# EAGLE design controller-main_3 (EAGLE 8.4.1)
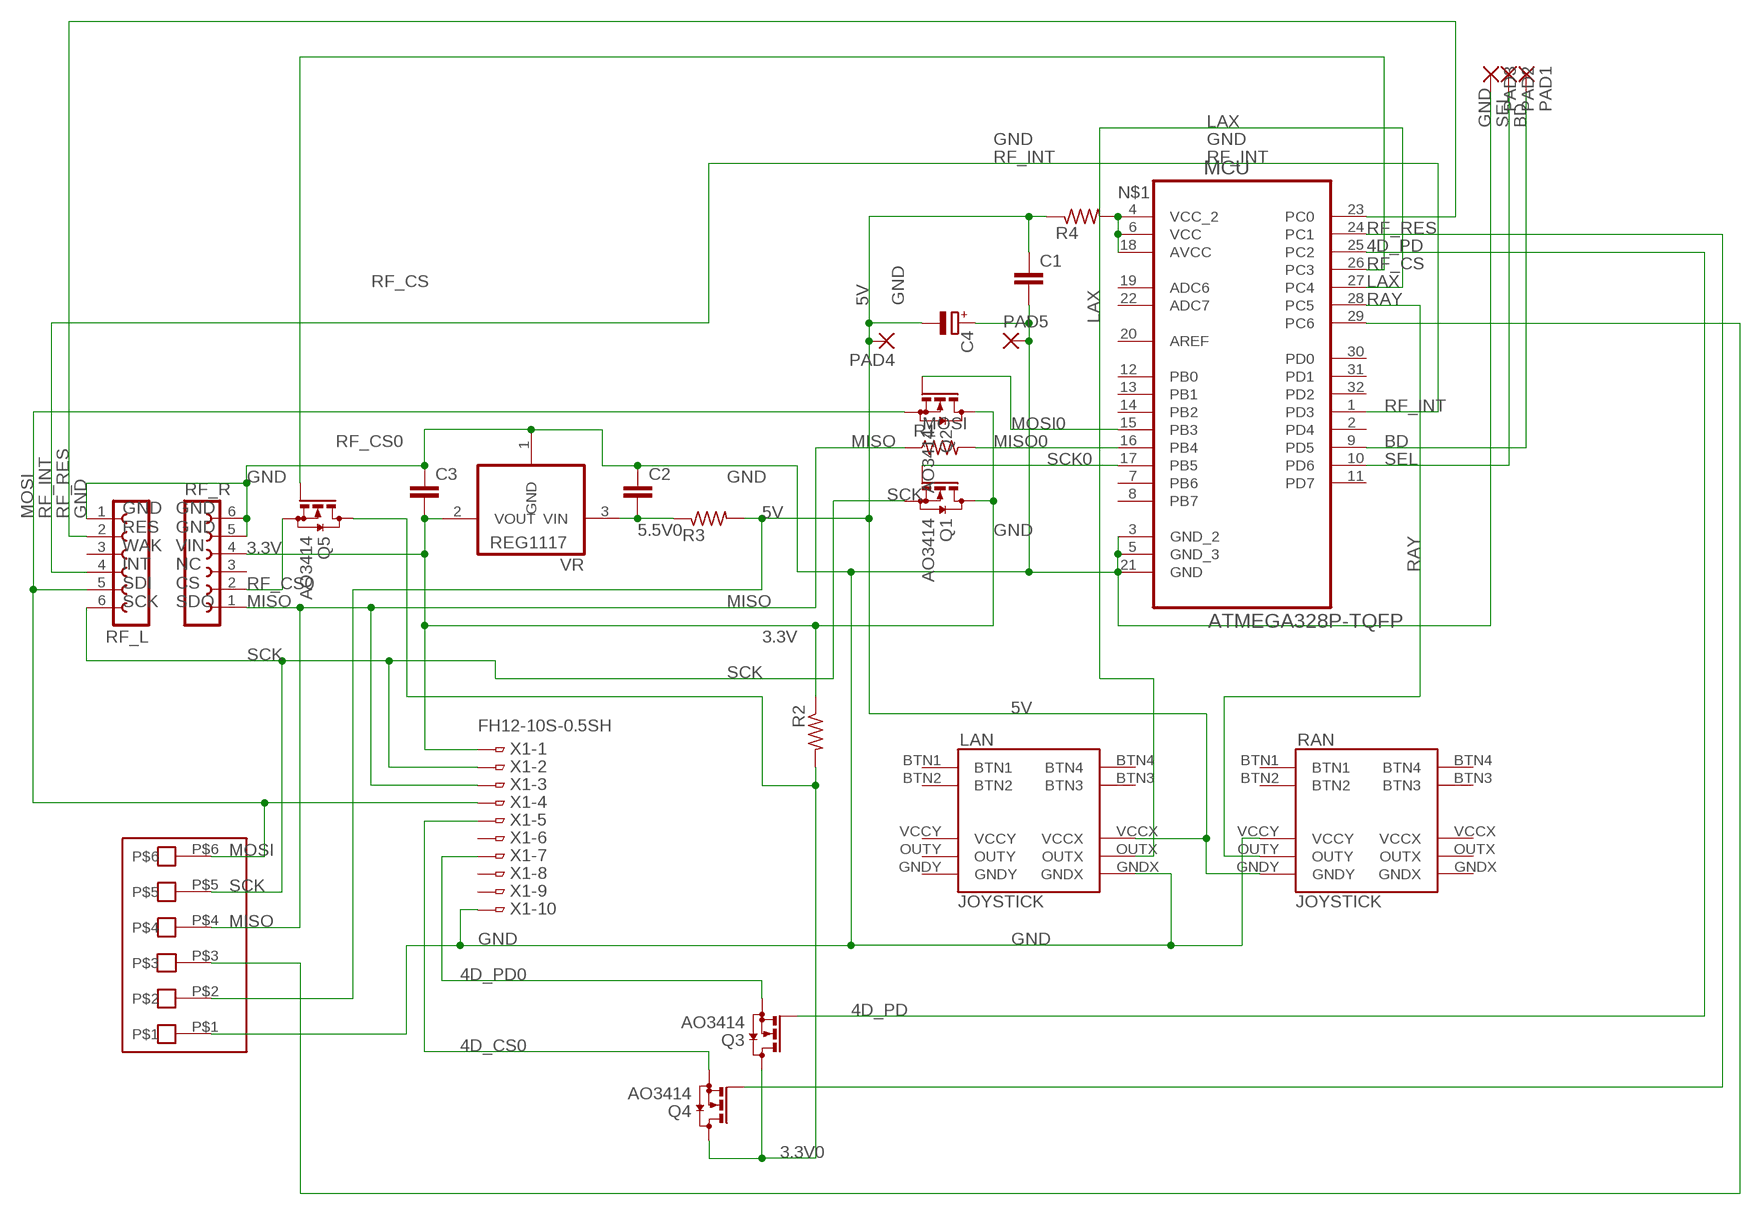
[diagram p0: schematic, sheet 1]

## Parts
C1  C-EUC1206  [C1206]
C2  C-EUC1206  [C1206]
C3  C-EUC1206  [C1206]
C4  CPOL-EU153CLV-0505  [153CLV-0505]
LAN  JOYSTICK  JOYSTICKJOYSTICKWBTN  [JOYSTICK]
MCU  ATMEGA328P-TQFP  ATMEGA328P-AU  [QFP80P900X900X120-32N]
PAD1  SMD2  [SMD1,27-2,54]
PAD2  SMD2  [SMD1,27-2,54]
PAD3  SMD2  [SMD1,27-2,54]
PAD4  SMD5  [SMD2,54-5,08]
PAD5  SMD5  [SMD2,54-5,08]
Q1  AO3414  BSS123  [SOT23]
Q2  AO3414  BSS123  [SOT23]
Q3  AO3414  BSS123  [SOT23]
Q4  AO3414  BSS123  [SOT23]
Q5  AO3414  BSS123  [SOT23]
R1  R-US_R1206  [R1206]
R2  R-US_R1206  [R1206]
R3  R-US_R1206  [R1206]
R4  R-US_R1206  [R1206]
RAN  JOYSTICK  JOYSTICKJOYSTICKWBTN  [JOYSTICK]
RF_L  FE06-1  [FE06]
RF_R  FE06-1  [FE06]
U$1  JTECH-6PV  [PAK-6PV]
VR  REG1117  [SOT223]
X1  FH12-10S-0.5SH  [FH12-10S-0.5SH]

## Nets
3.3V: C3.2 Q1.3(D) Q2.3(D) R2.1 RF_R.4 VR.2(VOUT) X1.1
3.3V0: Q3.3(D) Q4.3(D) Q5.3(D) R2.2
4D_CS: MCU.24(PC1) Q4.1(G)
4D_CS0: Q4.2(S) X1.5
4D_PD: MCU.25(PC2) Q3.1(G)
4D_PD0: Q3.2(S) X1.7
5.5V0: C2.2 R3.1 VR.3(VIN)
5V: C1.1 C4.- LAN.VCCX PAD4.1(P) R3.2 R4.1 RAN.GNDY U$1.P$2
BD: MCU.9(PD5) PAD1.1(P)
GND: C1.2 C2.1 C3.1 C4.+ LAN.GNDX MCU.3(GND_2) MCU.5(GND_3) MCU.21(GND) PAD3.1(P) PAD5.1(P) RAN.VCCY RF_L.1 RF_R.5 RF_R.6 U$1.P$1 VR.1(GND) X1.10
LAX: LAN.OUTX MCU.27(PC4)
MISO: R1.1 RF_R.1 U$1.P$4 X1.3
MISO0: MCU.16(PB4) R1.2
MOSI: Q2.2(S) RF_L.5 U$1.P$6 X1.4
MOSI0: MCU.15(PB3) Q2.1(G)
N$1: MCU.4(VCC_2) MCU.6(VCC) MCU.18(AVCC) R4.2
RAY: MCU.28(PC5) RAN.OUTY
RF_CS: MCU.26(PC3) Q5.1(G)
RF_CS0: Q5.2(S) RF_R.2
RF_INT: MCU.1(PD3) RF_L.4
RF_RES: MCU.23(PC0) RF_L.2
RST: MCU.29(PC6) U$1.P$3
SCK: Q1.2(S) RF_L.6 U$1.P$5 X1.2
SCK0: MCU.17(PB5) Q1.1(G)
SEL: MCU.10(PD6) PAD2.1(P)
Unconnected: LAN.BTN1 LAN.BTN2 LAN.BTN3 LAN.BTN4 LAN.GNDY LAN.OUTY LAN.VCCY MCU.2(PD4) MCU.7(PB6) MCU.8(PB7) MCU.11(PD7) MCU.12(PB0) MCU.13(PB1) MCU.14(PB2) MCU.19(ADC6) MCU.20(AREF) MCU.22(ADC7) MCU.30(PD0) MCU.31(PD1) MCU.32(PD2) RAN.BTN1 RAN.BTN2 RAN.BTN3 RAN.BTN4 RAN.GNDX RAN.OUTX RAN.VCCX RF_L.3 RF_R.3 X1.6 X1.8 X1.9

## Notes on the sheet
- GND
  RES
  WAK
  INT
  SDI
  SCK
- GND
  GND
  VIN
  NC
  CS
  SDO

## Library data of the parts
C1-C3 = resistor:C-EU: CAPACITOR, European symbol
C4 = resistor:CPOL-EU: POLARIZED CAPACITOR, European symbol
LAN RAN = joystick:JOYSTICK
MCU = Atmel_By_element14_Batch_1-00:ATMEGA328P-AU: 8-bit Microcontroller with In-System Programmable Flash; MPN: ATMEGA328P-AU; OC_FARNELL: 1715486; OC_NEWARK: 14R4631; PACKAGE: TQFP-32; SUPPLIER: Atmel
PAD1-PAD3 = wirepad:SMD2: SMD PAD
PAD4 PAD5 = wirepad:SMD5: SMD PAD
Q1-Q5 = transistor-small-signal:BSS123: N-CHANNEL MOS FET
R1-R4 = resistor:R-US_: RESISTOR, American symbol
RF_L RF_R = con-lsta:FE06-1: FEMALE HEADER; OC_FARNELL: unknown; OC_NEWARK: unknown
U$1 = con-jtech:JTECH-6P
VR = burr-brown:REG1117: 800mA and 1A Low Dropout (LDO) Positive Regulator 1.8V, 2.5V, 2.85V, 3.3V, 5V, and Adj; MPN: REG1117; OC_FARNELL: 1097566; OC_NEWARK: 14P6981
X1 = con-hirose:FH12-10S-0.5S: 0.5mm Pitch Connectors For FPC/FFC Source: Data sheet <http://www.hirose.co.jp/cataloge_hp/e58605370.pdf>; MPN: FH12-10S-0.5SH(55); OC_FARNELL: 1324540; OC_NEWARK: 34M6152

## Board
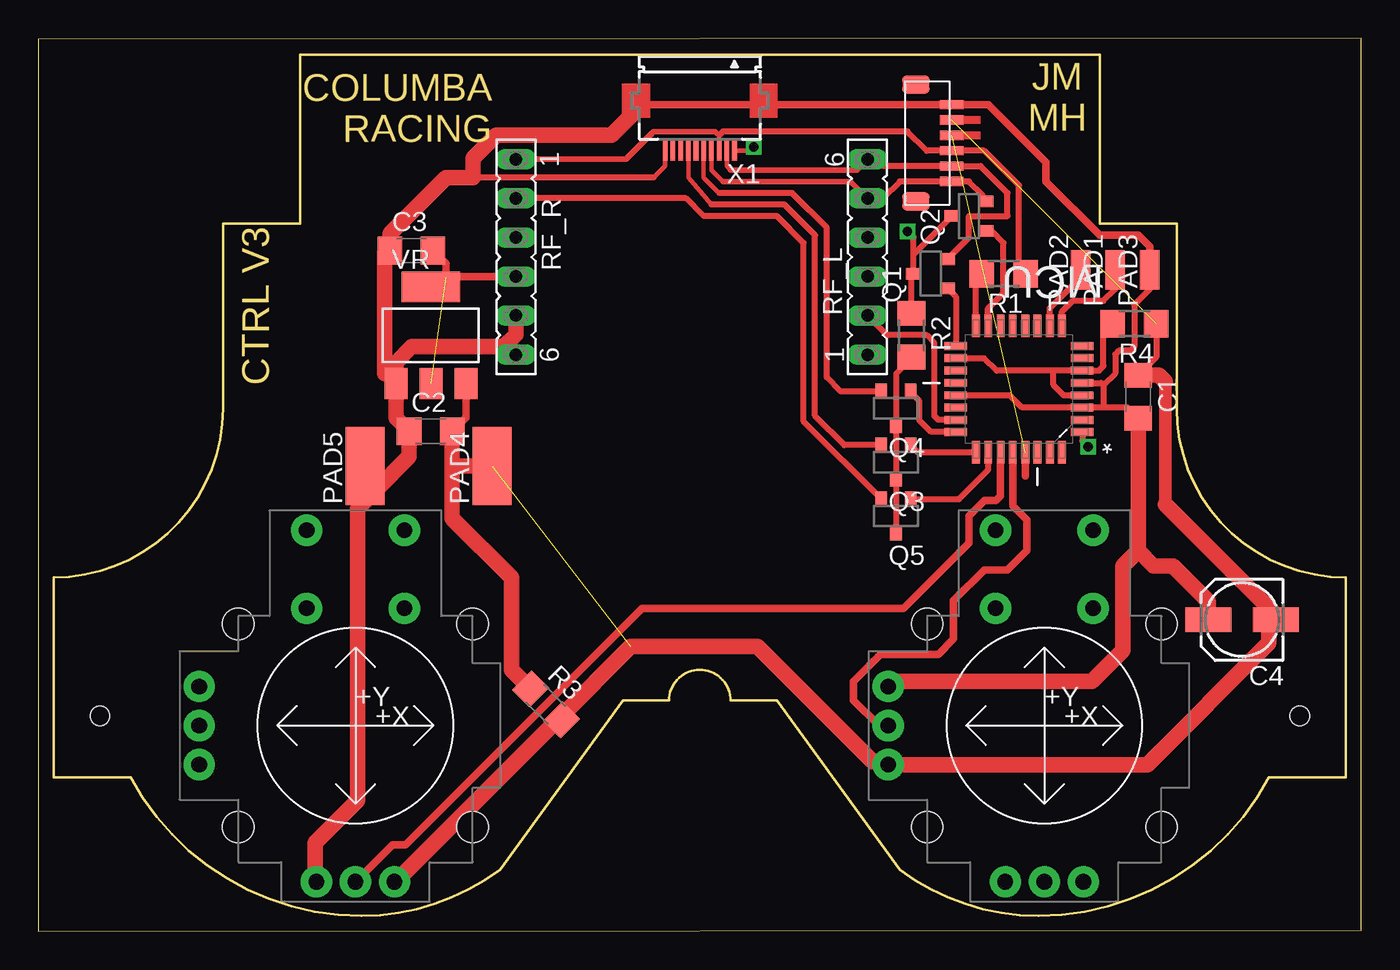
[diagram p1: board, top side]
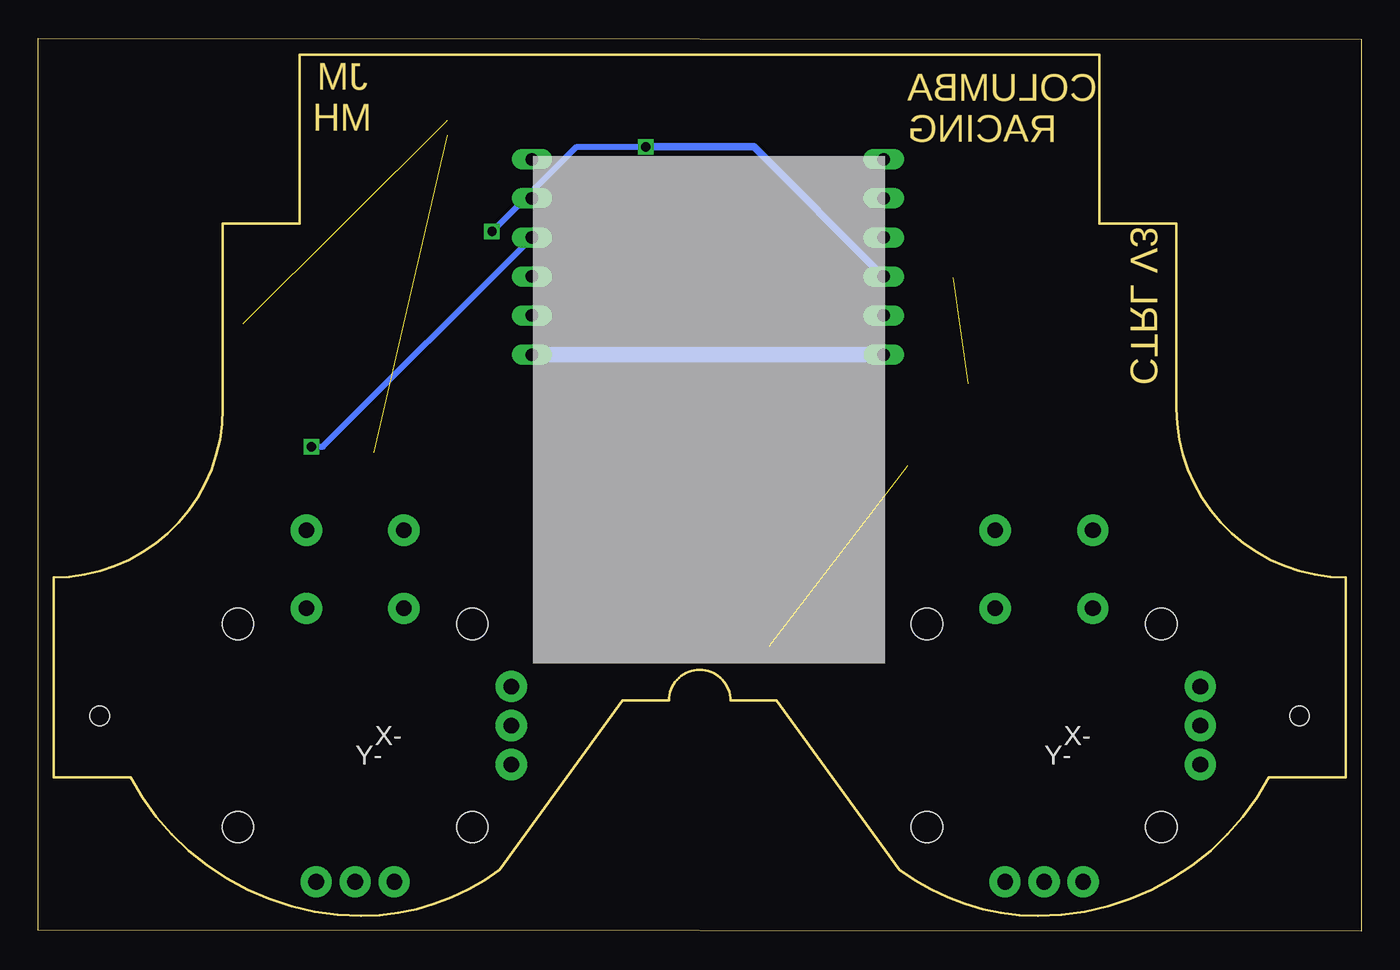
[diagram p2: board, bottom side, seen from below]

Size 85.99 x 58.05 mm. Coordinates in mm from the lower left corner, seen from the top.
Outline: 0,0 85.99,0.05 85.99,58.05 0,58 0,0
Outline: 17,57 69,57 69,46 74,46 74,34 arc90 85,23 85,10 80,10 arc-62 65,1 arc-37 56,4 48,15 45,15 arc90 43,17 arc90 41,15 38,15 30,4 arc-37 21,1 arc-62 6,10 1,10 1,23 arc90 12,34 12,46 17,46 17,57
Copper layers (1*16): Top 0.035mm / dielectric 1.5mm / Bottom 0.035mm
Design rules "default": minimum track width 6mil, minimum drill 0.35mm, track to track 6mil, track to pad 6mil, pad to pad 6mil, via to via 6mil, smd to smd 6mil, copper to edge 40mil, drill to drill 6mil, minimum pad ring 10mil, minimum via ring 8mil, stop-mask expansion 4mil, vias tented up to drill 0mil, thermal gap 10mil
Holes 1.25 mm at 4,14 82,14

### Footprints (pad centres in the part's own frame; a part is rotated, then mirrored left to right if it is on the bottom)
C1206 = smd 1.6 x 1.8: 1 -1.4,0; 2 1.4,0
153CLV-0505 = smd 3 x 1.6: + 2.2,0; - -2.2,0
JOYSTICK = drill 1.016 pad 2.032: BTN1 -3.175,12.7; BTN2 -3.175,7.62; BTN3 3.175,7.62; BTN4 3.175,12.7; GNDX -2.54,-10.16; GNDY -10.16,-2.54; OUTX 0,-10.16; OUTY -10.16,0; VCCX 2.54,-10.16; VCCY -10.16,2.54 | hole 2.032: -7.62,6.604; -7.62,-6.604; 7.62,6.604; 7.62,-6.604
QFP80P900X900X120-32N = smd 1.473 x 0.508: 1 -4.115,2.794; 2 -4.115,2.007; 3 -4.115,1.194; 4 -4.115,0.406; 5 -4.115,-0.406; 6 -4.115,-1.194; 7 -4.115,-2.007; 8 -4.115,-2.794; 17 4.115,-2.794; 18 4.115,-2.007; 19 4.115,-1.194; 20 4.115,-0.406; 21 4.115,0.406; 22 4.115,1.194; 23 4.115,2.007; 24 4.115,2.794 | smd 0.508 x 1.473: 9 -2.794,-4.115; 10 -2.007,-4.115; 11 -1.194,-4.115; 12 -0.406,-4.115; 13 0.406,-4.115; 14 1.194,-4.115; 15 2.007,-4.115; 16 2.794,-4.115; 25 2.794,4.115; 26 2.007,4.115; 27 1.194,4.115; 28 0.406,4.115; 29 -0.406,4.115; 30 -1.194,4.115; 31 -2.007,4.115; 32 -2.794,4.115
SMD1,27-2,54 = smd 1.27 x 2.54: 1 0,0
SMD2,54-5,08 = smd 2.54 x 5.08: 1 0,0
SOT23 = smd 0.75 x 1: 1 -0.95,-1.1; 2 0.95,-1.1; 3 0,1.1
R1206 = smd 1.6 x 1.803: 1 -1.422,0; 2 1.422,0
FE06 = drill 0.813 long: 1 -6.35,0; 2 -3.81,0; 3 -1.27,0; 4 1.27,0; 5 3.81,0; 6 6.35,0
PAK-6PV = smd 0.6 x 1.55: P$1 -2.5,1.125; P$2 -1.5,1.125; P$3 -0.5,1.125; P$4 0.5,1.125; P$5 1.5,1.125; P$6 2.5,1.125 | smd 1.2 x 1.8: P$7 -3.8,-1.2; P$8 3.8,-1.2
SOT223 = smd 1.499 x 2.007: 1 -2.261,-3.15; 2 0.025,-3.15; 3 2.311,-3.15 | smd 3.81 x 2.007: 4 0,3.15
FH12-10S-0.5SH = smd 0.3 x 1.3: 1 -2.25,3.25; 2 -1.75,3.25; 3 -1.25,3.25; 4 -0.75,3.25; 5 -0.25,3.25; 6 0.25,3.25; 7 0.75,3.25; 8 1.25,3.25; 9 1.75,3.25; 10 2.25,3.25

### Placement (x,y rotation side)
C1  71.5,34.75 270 top
C2  25.5,32.5 0 top
C3  24.25,44.25 0 top
C4  78.25,20.25 180 top
LAN  20.61,13.37 0 top
MCU  63.75,35.25 180 top
PAD1  70,43 0 top
PAD2  67.75,43 0 top
PAD3  72.25,43 0 top
PAD4  29.5,30.25 0 top
PAD5  21.25,30.25 0 top
Q1  58,42.75 90 top
Q2  60.5,46.5 90 top
Q3  55.75,30.5 180 top
Q4  55.75,34 180 top
Q5  55.75,27 180 top
R1  62.75,42.75 180 top
R2  56.75,38.75 270 top
R3  33,14.75 315 top
R4  71.25,39.5 180 top
RAN  65.4,13.37 0 top
RF_L  53.9,43.84 90 top
RF_R  31.04,43.84 270 top
U$1  58.25,51.25 270 top
VR  25.5,38.75 0 top
X1  43,54 180 top

### Tracks (layer width: path | path; a pad name or v marks a point on that pad's centre or on a via)
3.3V  (via drill 0.6)  (1 unrouted)
  Top 0.3: 46.25,50.75 X1.1
  Top 0.4: 56.9,44 Q1.3 56.75,42.6 R2.1 | 56.9,44 Q2.3 | 56.9,44 56.9,45.1 v56.5,45.5 | 26.5,42.5 26.57,42.57
  Top 0.5: v46.5,51 46.25,50.75 | C3.2 26.5,43.4 26.5,42.5 | 26.57,42.57 RF_R.4
  Bottom 0.4: v56.5,45.5 51,51 v46.5,51
  Bottom 0.5: RF_R.4 39.47,51 v46.5,51
3.3V0
  Top 0.4: R2.2 56.75,37.25 55.75,36.25 Q4.3 Q3.3 Q5.3
4D_CS
  Top 0.4: Q4.1 56.7,35.05 57.25,34.5 57.25,33.25 58,32.5 59.59,32.5 MCU.24
4D_CS0
  Top 0.3: 44.25,48 43.25,49 X1.5
  Top 0.4: Q4.2 52.15,35.1 51.25,36 51.25,45.75 49,48 44.25,48
4D_PD
  Top 0.4: MCU.25 57.16,31.14 Q3.1
4D_PD0
  Top 0.3: 43.75,47.25 42.25,49 X1.7
  Top 0.4: Q3.2 52.4,31.6 50.5,33.5 50.5,45.25 48.5,47.25 43.75,47.25
5.5V0
  Top 0.5: VR.3 27.81,33.41 C2.2
  Top 1: R3.1 30.75,17 30.75,23 26.9,26.85 C2.2
5V  (2 unrouted)
  Top 0.4: R4.1 72.67,37.32 C1.1
  Top 0.5: R3.2 | R3.2 33.88,13.88
  Top 0.8: 73.25,35.75 73.25,27.75
  Top 1: LAN.VCCX 23.21,3.21 33.88,13.88 38.5,18.5 46.75,18.5 54.25,11 55.07,11 RAN.GNDY 72.08,10.83 80,18.75 80,19.8 C4.- 80.45,20.55 73.25,27.75 | C1.1 72.85,36.15 73.25,35.75 | PAD4.1 27,30.25
BD
  Top 0.4: MCU.9 66.54,40.29 67.25,41 69.25,41 70,41.75 PAD1.1
GND
  Top 0.3: X1.10 40.75,49.75 40,49
  Top 0.4: C1.2 70.79,34.06 69.25,34.06 | 69.25,34.06 MCU.3 63.94,34.06 63.16,34.84 MCU.21 | 40,49 28.25,49 | 23.24,36.01 VR.1 | MCU.5 69.09,35.66 69.25,35.5 | 69.25,35.5 69.25,34.06 | PAD3.1 72.25,41.75 71.25,40.75 71.25,38 71,37.75 70.25,37.75 70,37.5 70,36.25 69.25,35.5
  Top 0.5: PAD3.1 72.25,44.5 71.5,45.25 69,45.25 65.5,48.75 65.5,50 61.75,53.75 U$1.P$1 39.25,53.75
  Top 1: VR.1 23.24,33.36 C2.1 24.1,30.85 21.88,28.62 | 21.88,28.62 20.75,27.5 20.75,8.5 18,5.75 18,3.28 LAN.GNDX | 30.25,38 24.25,38 23.24,36.99 23.24,36.01 22.5,36.25 22.5,44.1 C3.1 22.85,45.35 26.5,49 28.25,49 28.25,50.25 29.75,51.75 37.25,51.75 39.25,53.75 | 30.25,38 30.53,38 RF_R.6 | RF_R.5 31.04,38.79 30.25,38 | RAN.VCCY 55.58,16.25 68.5,16.25 70.5,18.25 70.5,23.75 71.5,24.75 | 71.5,24.75 C1.2 | PAD5.1 21.88,28.62 | C4.+ 76.05,21.45 73.75,23.75 72.5,23.75 71.5,24.75
  Bottom 1: RF_L.1 RF_R.6
LAX
  Top 0.5: MCU.27 62.56,28.31 62.25,28 61.5,28 60.5,27 60.5,25.25 56.25,21 39.25,21 23.86,5.61 23.01,5.61 LAN.OUTX
MISO
  Top 0.3: 44.25,51.75 X1.3
  Top 0.35: RF_R.1 38.19,50.19 40,52 44,52 44.25,51.75
  Top 0.4: 44.25,51.75 44.5,52 46.75,52 47.25,52 56.5,52 57.75,50.75 U$1.P$4 61.5,50.75 63.75,48.5 63.75,43.17 R1.1
MISO0
  Top 0.4: MCU.16 60.96,42.38 R1.2
MOSI
  Top 0.3: 44.5,48.75 43.75,49.5 X1.4
  Top 0.35: RF_L.5 52.8,48.75 44.5,48.75
  Top 0.4: Q2.2 61.4,47.65 61.4,47.85 60.5,48.75 U$1.P$6 56,48.75 54.9,47.65 RF_L.5
MOSI0
  Top 0.4: MCU.15 61.74,40.49 62.75,41.5 62.75,44.75 61.95,45.55 Q2.1
N$1
  Top 0.4: R4.2 69.25,38.92 69.25,36.75 68.94,36.44 MCU.6 66,36.44 | 66,36.44 62.31,36.44 61.5,37.25 MCU.18 | MCU.4 66.66,34.84 66,35.5 66,36.44
RAY
  Top 0.5: MCU.28 63.34,27.66 64.25,26.75 64.25,24.75 63,23.5 61.5,23.5 59.5,21.5 59.5,19 58.5,18 54.75,18 53,16.25 53,15 54.63,13.37 RAN.OUTY
RF_CS
  Top 0.4: MCU.26 61.74,29.99 59.85,28.1 Q5.1
RF_CS0
  Top 0.4: RF_R.2 42.1,47.65 43.25,46.5 48,46.5 49.75,44.75 49.75,33.15 Q5.2
RF_INT  (via drill 0.6)
  Top 0.4: MCU.1 67.86,31.89 v68.25,31.5
  Bottom 0.4: v68.25,31.5 67.51,31.5 RF_L.4
RF_RES
  Top 0.4: MCU.23 58.51,33.24 58.25,33.5 58.25,38.25 57.75,38.75 55.18,38.75 RF_L.2
RST  (1 unrouted)
  Top 0.5: MCU.29 64.16,29.59
SCK
  Top 0.3: 45,49.5 44.75,49.75 X1.2
  Top 0.35: 45,49.5 53.21,49.5 RF_L.6 53.96,50.25
  Top 0.4: Q1.2 60.5,45.1 60.5,46.5 63,46.5 63,48 61.25,49.75 U$1.P$5 54.34,49.75 RF_L.6 54.81,50.19
SCK0
  Top 0.4: Q1.1 59.63,41.27 MCU.17
SEL
  Top 0.4: MCU.10 65.76,40.51 67.75,42.5 PAD2.1
(copper drawn outside any net)
  shapes: Top area x2

### Text on the board
Milling: COLUMBA / RACING | JM / MH | CTRL V3